# Altium schematic sheet 7a - Controller.SchDoc
size 355 x 241 mm
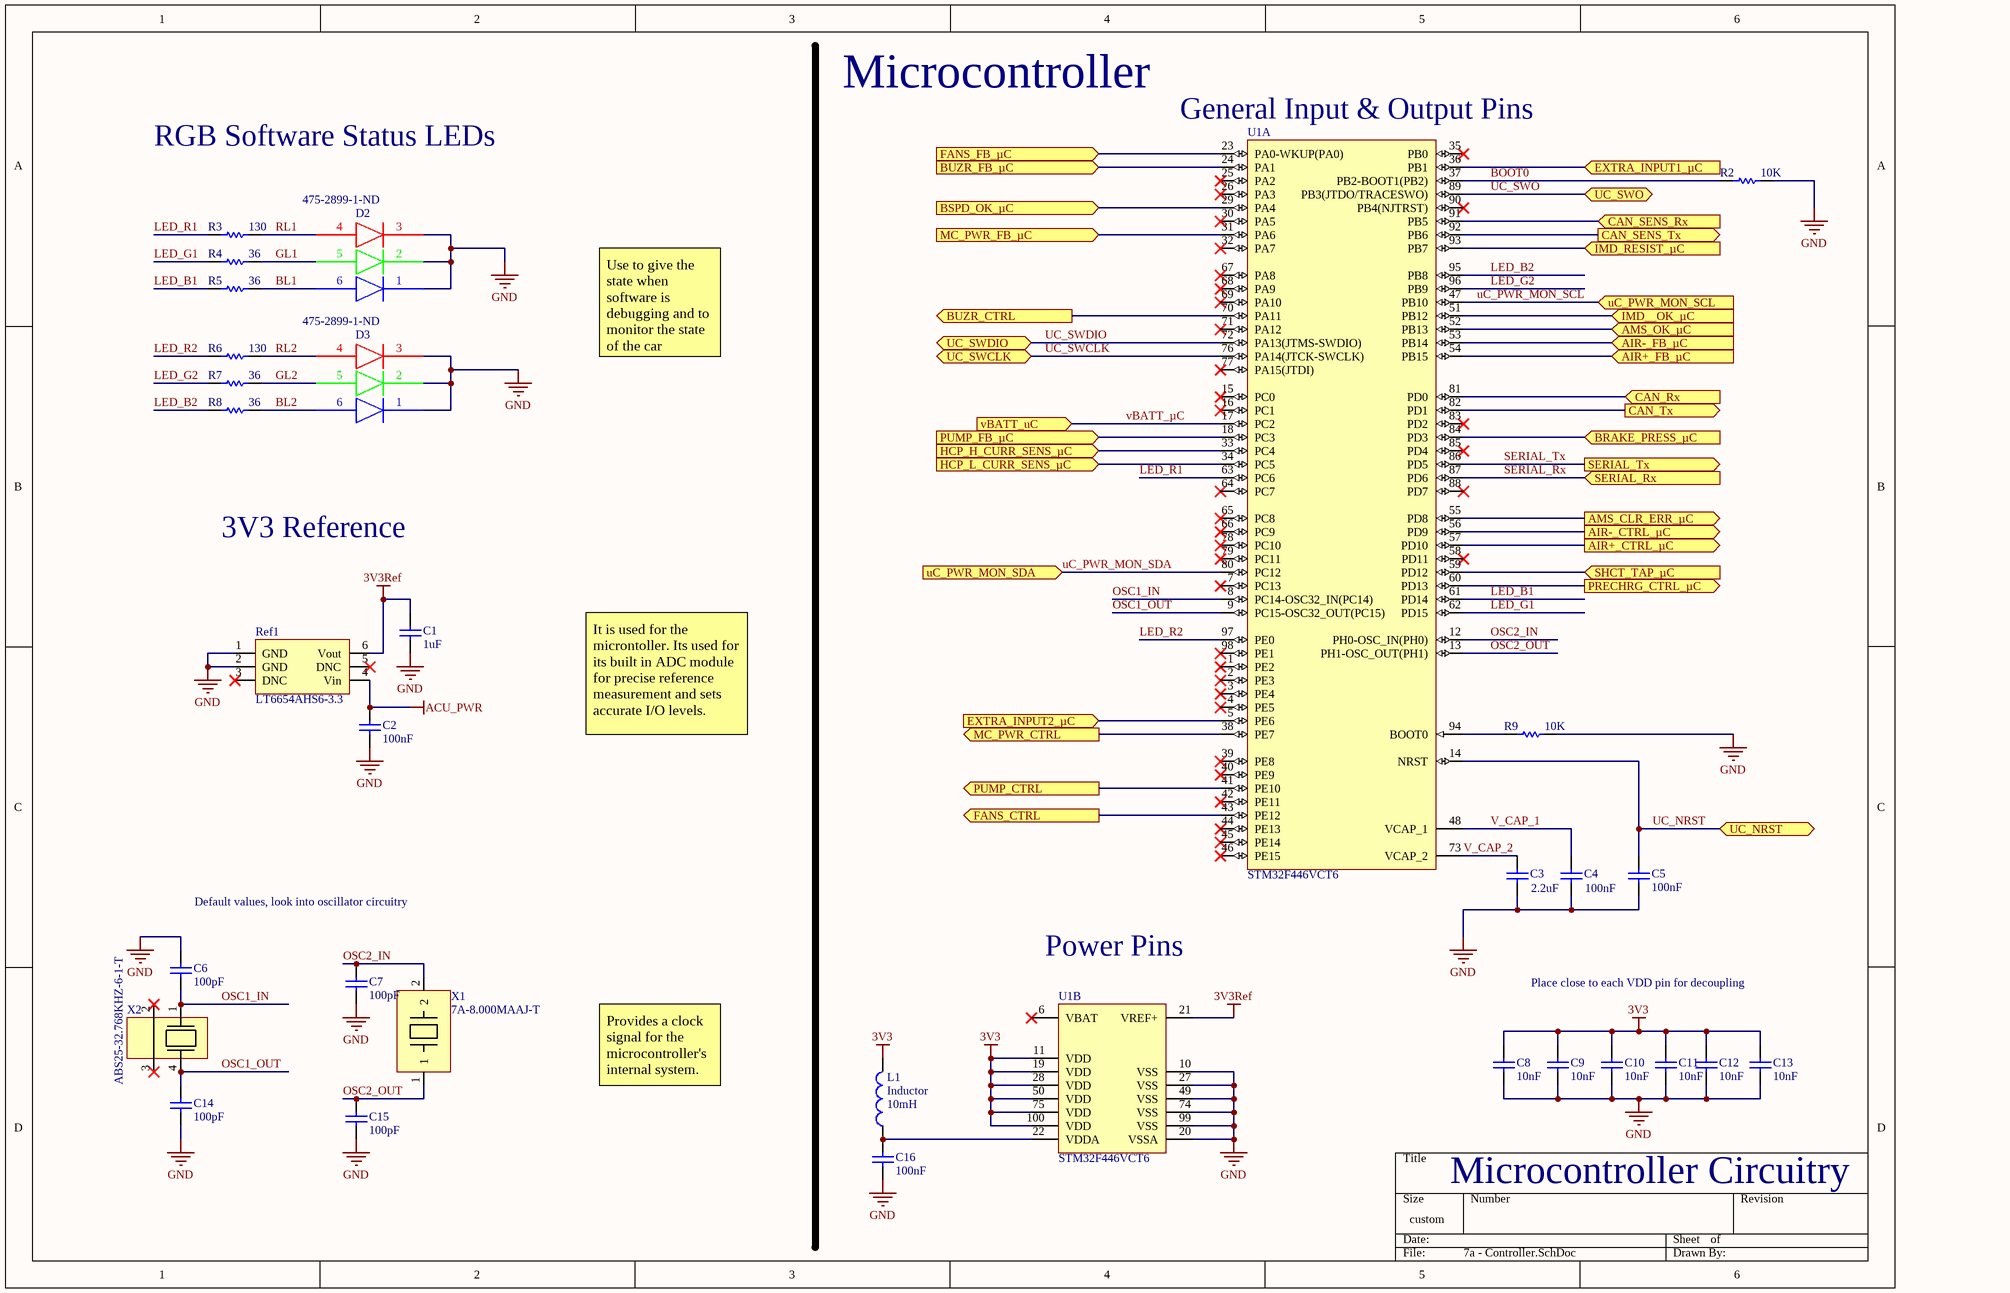
[diagram p0: 7a - Controller.SchDoc]

## Parts
C1  value 1uF  [1608[0603]]  (hidden comment: Cap)
C2  value 100nF  [1608[0603]]  (hidden comment: Cap)
C3  2.2uF  [CAPC0603(1608)100_N]
C4  100nF  [CAPC0603(1608)100_N]
C5  value 100nF  [1608[0603]]  (hidden comment: Cap)
C6  value 100pF  [1608[0603]]  (hidden comment: Cap)
C7  value 100pF  [1608[0603]]  (hidden comment: Cap)
C8  value 10nF  [1608[0603]]  (hidden comment: Cap)
C9  value 10nF  [1608[0603]]  (hidden comment: Cap)
C10  value 10nF  [1608[0603]]  (hidden comment: Cap)
C11  value 10nF  [1608[0603]]  (hidden comment: Cap)
C12  value 10nF  [1608[0603]]  (hidden comment: Cap)
C13  value 10nF  [1608[0603]]  (hidden comment: Cap)
C14  value 100pF  [1608[0603]]  (hidden comment: Cap)
C15  value 100pF  [1608[0603]]  (hidden comment: Cap)
C16  value 100nF  [1608[0603]]  (hidden comment: Cap)
D2  Supplier Part Number 1: 475-2899-1-ND  [CLX6C-FKB]
D3  Supplier Part Number 1: 475-2899-1-ND  [CLX6C-FKB]
L1  Inductor  value 10mH  [0402-A]
R2  value 10K  [1608[0603]]  (hidden comment: Res1)
R3  value 130  [1608[0603]]  (hidden comment: Res1)
R4  value 36  [1608[0603]]  (hidden comment: Res1)
R5  value 36  [1608[0603]]  (hidden comment: Res1)
R6  value 130  [1608[0603]]  (hidden comment: Res1)
R7  value 36  [1608[0603]]  (hidden comment: Res1)
R8  value 36  [1608[0603]]  (hidden comment: Res1)
R9  value 10K  [1608[0603]]  (hidden comment: Res1)
Ref1  LT6654AHS6-3.3  [TSOT-23]
U1  STM32F446VCT6  [STM-LQFP100_L]  (parts A,B of 2)
X1  7A-8.000MAAJ-T  [5 x 3.2 mm SMD]
X2  ABS25-32.768KHZ-6-1-T  [SOJ-4, 5.5mm Pitch]

## Ports
AIR+_CTRL_µC (out), AIR+_FB_µC (in), AIR-_CTRL_µC (out), AIR-_FB_µC (in), AMS_CLR_ERR_µC (out), AMS_OK_µC (in), BRAKE_PRESS_µC (in), BSPD_OK_µC (in), BUZR_CTRL (out), BUZR_FB_µC (in), CAN_Rx (in), CAN_SENS_Rx (in), CAN_SENS_Tx (out), CAN_Tx (out), EXTRA_INPUT1_µC (in), EXTRA_INPUT2_µC (in), FANS_CTRL (out), FANS_FB_µC (in), HCP_H_CURR_SENS_µC (in), HCP_L_CURR_SENS_µC (in), IMD__OK_µC (in), IMD_RESIST_µC (in), MC_PWR_CTRL (out), MC_PWR_FB_µC (in), PRECHRG_CTRL_µC (out), PUMP_CTRL (out), PUMP_FB_µC (in), SERIAL_Rx (in), SERIAL_Tx (out), SHCT_TAP_µC (in), UC_NRST (bidir), uC_PWR_MON_SCL (in), uC_PWR_MON_SDA (in), UC_SWCLK (bidir), UC_SWDIO (bidir), UC_SWO (bidir), vBATT_uC (in)

## Nets
3V3: C8.2 C9.2 C10.2 C11.2 C12.2 C13.2 L1.2 U1.11(VDD) U1.19(VDD) U1.28(VDD) U1.50(VDD) U1.75(VDD) U1.100(VDD)
3V3Ref: C1.2 Ref1.6(Vout) U1.21(VREF+)
ACU_PWR: C2.2 Ref1.4(Vin)
GND: C1.1 C2.1 C3.1 C4.1 C5.1 C6.2 C7.1 C8.1 C9.1 C10.1 C11.1 C12.1 C13.1 C14.1 C15.1 C16.1 D2.1(B) D2.2(G) D2.3(R) D3.1(B) D3.2(G) D3.3(R) R2.2 R9.2 Ref1.1(GND) Ref1.2(GND) U1.10(VSS) U1.20(VSSA) U1.27(VSS) U1.49(VSS) U1.74(VSS) U1.99(VSS)
AIR+_CTRL_µC: U1.57(PD10) ; port AIR+_CTRL_µC
AIR+_FB_µC: U1.54(PB15) ; port AIR+_FB_µC
AIR-_CTRL_µC: U1.56(PD9) ; port AIR-_CTRL_µC
AIR-_FB_µC: U1.53(PB14) ; port AIR-_FB_µC
AMS_CLR_ERR_µC: U1.55(PD8) ; port AMS_CLR_ERR_µC
AMS_OK_µC: U1.52(PB13) ; port AMS_OK_µC
BL1: D2.6(B) R5.2
BL2: D3.6(B) R8.2
BOOT0: R2.1 U1.37(PB2-BOOT1(PB2))
BRAKE_PRESS_µC: U1.84(PD3) ; port BRAKE_PRESS_µC
BSPD_OK_µC: U1.29(PA4) ; port BSPD_OK_µC
BUZR_CTRL: U1.70(PA11) ; port BUZR_CTRL
BUZR_FB_µC: U1.24(PA1) ; port BUZR_FB_µC
CAN_Rx: U1.81(PD0) ; port CAN_Rx
CAN_SENS_Rx: U1.91(PB5) ; port CAN_SENS_Rx
CAN_SENS_Tx: U1.92(PB6) ; port CAN_SENS_Tx
CAN_Tx: U1.82(PD1) ; port CAN_Tx
EXTRA_INPUT1_µC: U1.36(PB1) ; port EXTRA_INPUT1_µC
EXTRA_INPUT2_µC: U1.5(PE6) ; port EXTRA_INPUT2_µC
FANS_CTRL: U1.43(PE12) ; port FANS_CTRL
FANS_FB_µC: U1.23(PA0-WKUP(PA0)) ; port FANS_FB_µC
GL1: D2.5(G) R4.2
GL2: D3.5(G) R7.2
HCP_H_CURR_SENS_µC: U1.33(PC4) ; port HCP_H_CURR_SENS_µC
HCP_L_CURR_SENS_µC: U1.34(PC5) ; port HCP_L_CURR_SENS_µC
IMD__OK_µC: U1.51(PB12) ; port IMD__OK_µC
IMD_RESIST_µC: U1.93(PB7) ; port IMD_RESIST_µC
LED_B1: R5.1 U1.61(PD14)
LED_B2: R8.1 U1.95(PB8)
LED_G1: R4.1 U1.62(PD15)
LED_G2: R7.1 U1.96(PB9)
LED_R1: R3.1 U1.63(PC6)
LED_R2: R6.1 U1.97(PE0)
MC_PWR_CTRL: U1.38(PE7) ; port MC_PWR_CTRL
MC_PWR_FB_µC: U1.31(PA6) ; port MC_PWR_FB_µC
OSC1_IN: C6.1 U1.8(PC14-OSC32_IN(PC14)) X2.1
OSC1_OUT: C14.2 U1.9(PC15-OSC32_OUT(PC15)) X2.4
OSC2_IN: C7.2 U1.12(PH0-OSC_IN(PH0)) X1.2
OSC2_OUT: C15.2 U1.13(PH1-OSC_OUT(PH1)) X1.1
PRECHRG_CTRL_µC: U1.60(PD13) ; port PRECHRG_CTRL_µC
PUMP_CTRL: U1.41(PE10) ; port PUMP_CTRL
PUMP_FB_µC: U1.18(PC3) ; port PUMP_FB_µC
RL1: D2.4(R) R3.2
RL2: D3.4(R) R6.2
SERIAL_Rx: U1.87(PD6) ; port SERIAL_Rx
SERIAL_Tx: U1.86(PD5) ; port SERIAL_Tx
SHCT_TAP_µC: U1.59(PD12) ; port SHCT_TAP_µC
UC_NRST: C5.2 U1.14(NRST) ; port UC_NRST
uC_PWR_MON_SCL: U1.47(PB10) ; port uC_PWR_MON_SCL
uC_PWR_MON_SDA: U1.80(PC12) ; port uC_PWR_MON_SDA
UC_SWCLK: U1.76(PA14(JTCK-SWCLK)) ; port UC_SWCLK
UC_SWDIO: U1.72(PA13(JTMS-SWDIO)) ; port UC_SWDIO
UC_SWO: U1.89(PB3(JTDO/TRACESWO)) ; port UC_SWO
V_CAP_1: C4.2 U1.48(VCAP_1)
V_CAP_2: C3.2 U1.73(VCAP_2)
vBATT_µC: U1.17(PC2) ; port vBATT_uC
NetC16_2: C16.2 L1.1 U1.22(VDDA)
NetR9_1: R9.1 U1.94(BOOT0)

Not connected (* = marked no-connect by the designer): Ref1 3(DNC)* 5(DNC)*; U1 1(PE2)* 2(PE3)* 3(PE4)* 4(PE5)* 6(VBAT)* 7(PC13)* 15(PC0)* 16(PC1)* 25(PA2)* 26(PA3)* 30(PA5)* 32(PA7)* 35(PB0)* 39(PE8)* 40(PE9)* 42(PE11)* 44(PE13)* 45(PE14)* 46(PE15)* 58(PD11)* 64(PC7)* 65(PC8)* 66(PC9)* 67(PA8)* 68(PA9)* 69(PA10)* 71(PA12)* 77(PA15(JTDI))* 78(PC10)* 79(PC11)* 83(PD2)* 85(PD4)* 88(PD7)* 90(PB4(NJTRST))* 98(PE1)*; X2 2* 3*

## Notes on the sheet
- Microcontroller
- RGB Software Status LEDs
- (near U1) General Input & Output Pins
- Use to give the state when software is debugging and to monitor the state of the car
- 3V3 Reference
- It is used for the microntoller. Its used for its built in ADC module for precise reference measurement and sets accurate I/O levels.
- Default values, look into oscillator circuitry
- Power Pins
- Place close to each VDD pin for decoupling
- Provides a clock signal for the microcontroller's internal system.
- Microcontroller Circuitry

## Library data of the parts
C1 C2 C5-C16 = Cap: Capacitor; Published: 8-Jun-2000; LatestRevisionDate: 17-Jul-2002; LatestRevisionNote: Re-released for DXP Platform.; PackageReference: RAD-0.3; Publisher: Altium Limited; PackageDescription: Radial Cap, Thru-Hole; 2 Leads; 0.3 in Pin Spacing
C3 C4 = CMP-1035-02582-1: CAP 100nF 10V -20% to +80% 0603 (1608 Metric) Thickness 1mm SMD; Case-Metric: 1608; Case-EIA: 0603; Rated Voltage: 10 V; Value: 100nF; Technology: SMT; Max Thickness: 1 mm; Tolerance: -20% to +80%
D2 D3 = LED - CLX6C-FKB-CGJKNCFBB789363 RGB: Manufacturer: Cree Inc.; Color: Red, Green, Blue (RGB); Lens Color: White; Lens Transparency: Diffused; Millicandela Rating: 420mcd Red, 840mcd Green, 196mcd Blue; Lens Style/Size: Square with Flat Top, 1.00mm; Voltage - Forward (Vf) (Typ): 1.9V Red, 3V Green, 3V Blue; Current - Test: 8mA Red, 8mA Green, 8mA Blue; Wavelength - Dominant: 622nm Red, 531nm Green, 470nm Blue; Manufacturer Part Number: CLX6C-FKB-CGJKNCFBB789363; RoHS: RoHS Compliant; Category: Optoelectronics; Packaging: Cut Tape (CT); Part Status: Active; Viewing Angle: -; Mounting Type: Surface Mount; Wavelength - Peak: -; Features: -; Package / Case: 6-SMD, J-Lead; Supplier Device Package: 6-PLCC; Size / Dimension: 3.40mm L x 3.40mm W; Height (Max): 2.90mm; ComponentLink1URL: http://www.cree.com/~/media/Files/Cree/LED-Components-and-Modules/HB/Data-Sheets/1281-CLX6C-FKB.pdf; ComponentLink1Description: http://www.cree.com/~/media/Files/Cree/LED-Components-and-Modules/HB/Data-Sheets/1281-CLX6C-FKB.pdf; Supplier 1: Digi-Key
L1 = Inductor: Code_IEC: 1005; Published: 8-Jun-2000; LatestRevisionDate: 29-May-2009; LatestRevisionNote: IPC-7351 Footprint Added.; PackageReference: 0402-A; Publisher: Altium Limited; PackageDescription: Chip Inductor; Code_JEITA: 0402
R2-R9 = Res1: Resistor; Published: 8-Jun-2000; LatestRevisionDate: 17-Jul-2002; LatestRevisionNote: Re-released for DXP Platform.; PackageReference: AXIAL-0.3; Publisher: Altium Limited; PackageDescription: Axial Device, Thru-Hole; 2 Leads; 0.3 in Pin Spacing
Ref1 = LT6654AHS6-3.3: TSOT-23-56; Manufacturer: Linear Technology; Reference Type: Series; Output Type: Fixed; Voltage - Output (Min/Fixed): 3.3V; Current - Output: 10mA; Tolerance: ±0.05%; Temperature Coefficient: 10ppm/°C; Noise - 0.1Hz to 10Hz: 1.7ppmp-p; Noise - 10Hz to 10kHz: 2ppmrms; Voltage - Input: 3.8 V ~ 36 V; Current - Supply: 600µA; Manufacturer Part Number: LT6654AHS6-3.3; Digikey Part Number: LT6654AHS6-3.3#TRMPBFCT-ND; Digikey Link: http://www.digikey.com/product-detail/en/linear-technology/LT6654AHS6-3.3-TRMPBF/LT6654AHS6-3.3-TRMPBFCT-ND/2485839; Supplier 1: Digi-Key; Supplier Part Number 1: LT6654AHS6-3.3#TRMPBFCT-ND; RoHS: RoHS Compliant; Category: Integrated Circuits (ICs); Stock 1: 1315; Pricing 1: 1=9.53, 25=8.508, 100=5.5596, 250=5.1048 (CAD); Packaging: Cut Tape (CT); Part Status: Active; Voltage - Output (Max): -; Current - Cathode: -; Operating Temperature: -40°C ~ 125°C (TA); Mounting Type: Surface Mount; Package / Case: SOT-23-6 Thin, TSOT-23-6; Supplier Device Package: TSOT-23-6; ComponentLink1URL: http://www.linear.com/docs/29677; ComponentLink1Description: http://www.linear.com/docs/29677
U1 = CMP-0243-00219-1: ARM Cortex-M4 32-bit MCU+FPU, 256 KB Flash, 128 KB Internal RAM, 81 I/Os, 100-Pin LQFP, -40 to 85 degC, Tray; D/A Converter: 2; Operating Frequency(F) (Processor speed) (MHz): 180; I/Os (High Current): 81; Supply Voltage(Vcc) min (V): 1.7; Internal RAM Size (kB): 128; FLASH Size (Prog) (kB): 256; Package Reference: 100-Pin Low Profile Quad Flat Package, Body 14 x 14 mm, Pitch 0.5 mm; Packing: Tray; ComponentLink1URL: http://www.st.com/; ComponentLink1Description: Manufacturer URL; ComponentLink2URL: http://www.st.com/st-web-ui/static/active/en/resource/technical/document/datasheet/DM00141306.pdf; Mounting Technology: Surface Mount; DatasheetVersion: Rev. 6; ComponentLink2Description: Datasheet; Core: ARM Cortex-M4; Package Description: LQFP100
X1 = 8MHz crystal, 7A-8.000MAAJ-T: Manufacturer: TXC CORPORATION; Frequency: 8MHz; Frequency Stability: ±30ppm; Load Capacitance: 18pF; ESR (Equivalent Series Resistance): 80 Ohm; Operating Mode: Fundamental; Supplier 1: Digi-Key; Manufacturer Part Number: 7A-8.000MAAJ-T; RoHS: RoHS Compliant; Category: Crystals, Oscillators, Resonators; Stock 1: 30692; Pricing 1: 1=1.12, 10=0.989, 50=0.9234, 100=0.8162, 500=0.77322 (CAD); Packaging: Cut Tape (CT); Part Status: Active; Type: MHz Crystal; Frequency Tolerance: ±30ppm; Operating Temperature: -20°C ~ 70°C; Ratings: -; Mounting Type: Surface Mount; Package / Case: 2-SMD, No Lead; Size / Dimension: 0.197" L x 0.126" W (5.00mm x 3.20mm); Height - Seated (Max): 0.053" (1.35mm); ComponentLink1URL: http://www.txccrystal.com/images/pdf/7a.pdf; ComponentLink1Description: http://www.txccrystal.com/images/pdf/7a.pdf; Supplier Part Number 1: 887-1448-1-ND
X2 = ABS25-32.768KHZ-6-1-T: Manufacturer: Abracon LLC; Frequency Tolerance: ±10ppm; Load Capacitance: 6pF; ESR (Equivalent Series Resistance): 50 kOhm; Operating Mode: Fundamental; Frequency: 32.768kHz; Manufacturer Part Number: ABS25-32.768KHZ-6-1-T; Digikey Part Number: 535-10241-1-ND; Digikey Link: http://www.digikey.ca/product-detail/en/abracon-llc/ABS25-32.768KHZ-6-1-T/535-10241-1-ND/2218054; Supplier 1: Digi-Key; Supplier Part Number 1: 535-10241-1-ND; RoHS: RoHS Compliant; Category: Crystals, Oscillators, Resonators; Stock 1: 47244; Pricing 1: 1=1, 10=0.837, 50=0.7538, 100=0.6701, 500=0.63664, 1000=0.5361 (CAD); Packaging: Cut Tape (CT); Part Status: Active; Type: kHz Crystal (Tuning Fork); Frequency Stability: -; Operating Temperature: -40°C ~ 85°C; Ratings: -; Mounting Type: Surface Mount; Package / Case: 4-SOJ, 5.50mm pitch; Size / Dimension: 0.315" L x 0.150" W (8.00mm x 3.80mm); Height - Seated (Max): 0.098" (2.50mm); ComponentLink1URL: http://www.abracon.com/Resonators/abs25.pdf; ComponentLink1Description: http://www.abracon.com/Resonators/abs25.pdf